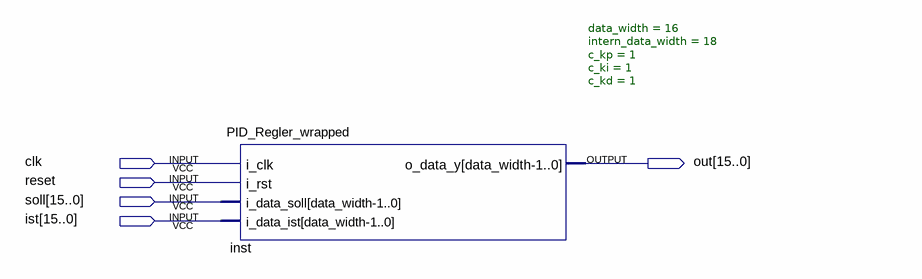
[diagram p0: schematic sheet]
// Quartus schematic PID_wrapped_BDF.bdf as structural Verilog: 1 symbols, 5 pins
module PID_wrapped_BDF (
  input  clk,
  input  reset,
  input  [15:0] soll,
  input  [15:0] ist,
  output [15:0] out
);

  PID_Regler_wrapped #(.data_width(16), .intern_data_width(18), .c_kp(1), .c_ki(1), .c_kd(1)) inst (
    .i_clk(clk), .i_rst(reset), .i_data_soll(soll), .i_data_ist(ist), .o_data_y(out));
endmodule
